# Altium schematic sheet EVB-ANNA-B5_SCHEM_0003_USBhub_FTDI.SchDoc
size A3; Date: 7/24/2020; CompanyName: U-blox; DrawnBy: EMOO; Engineer: EMOO; Organization: U-blox; Address1: 3950 Fairview Industrial Dr SE #100; Address2: Salem, OR 97302; DocumentNumber: 8; SheetNumber: 4; SheetTotal: 8; SheetSize: B; SheetTitle: Interface MCU
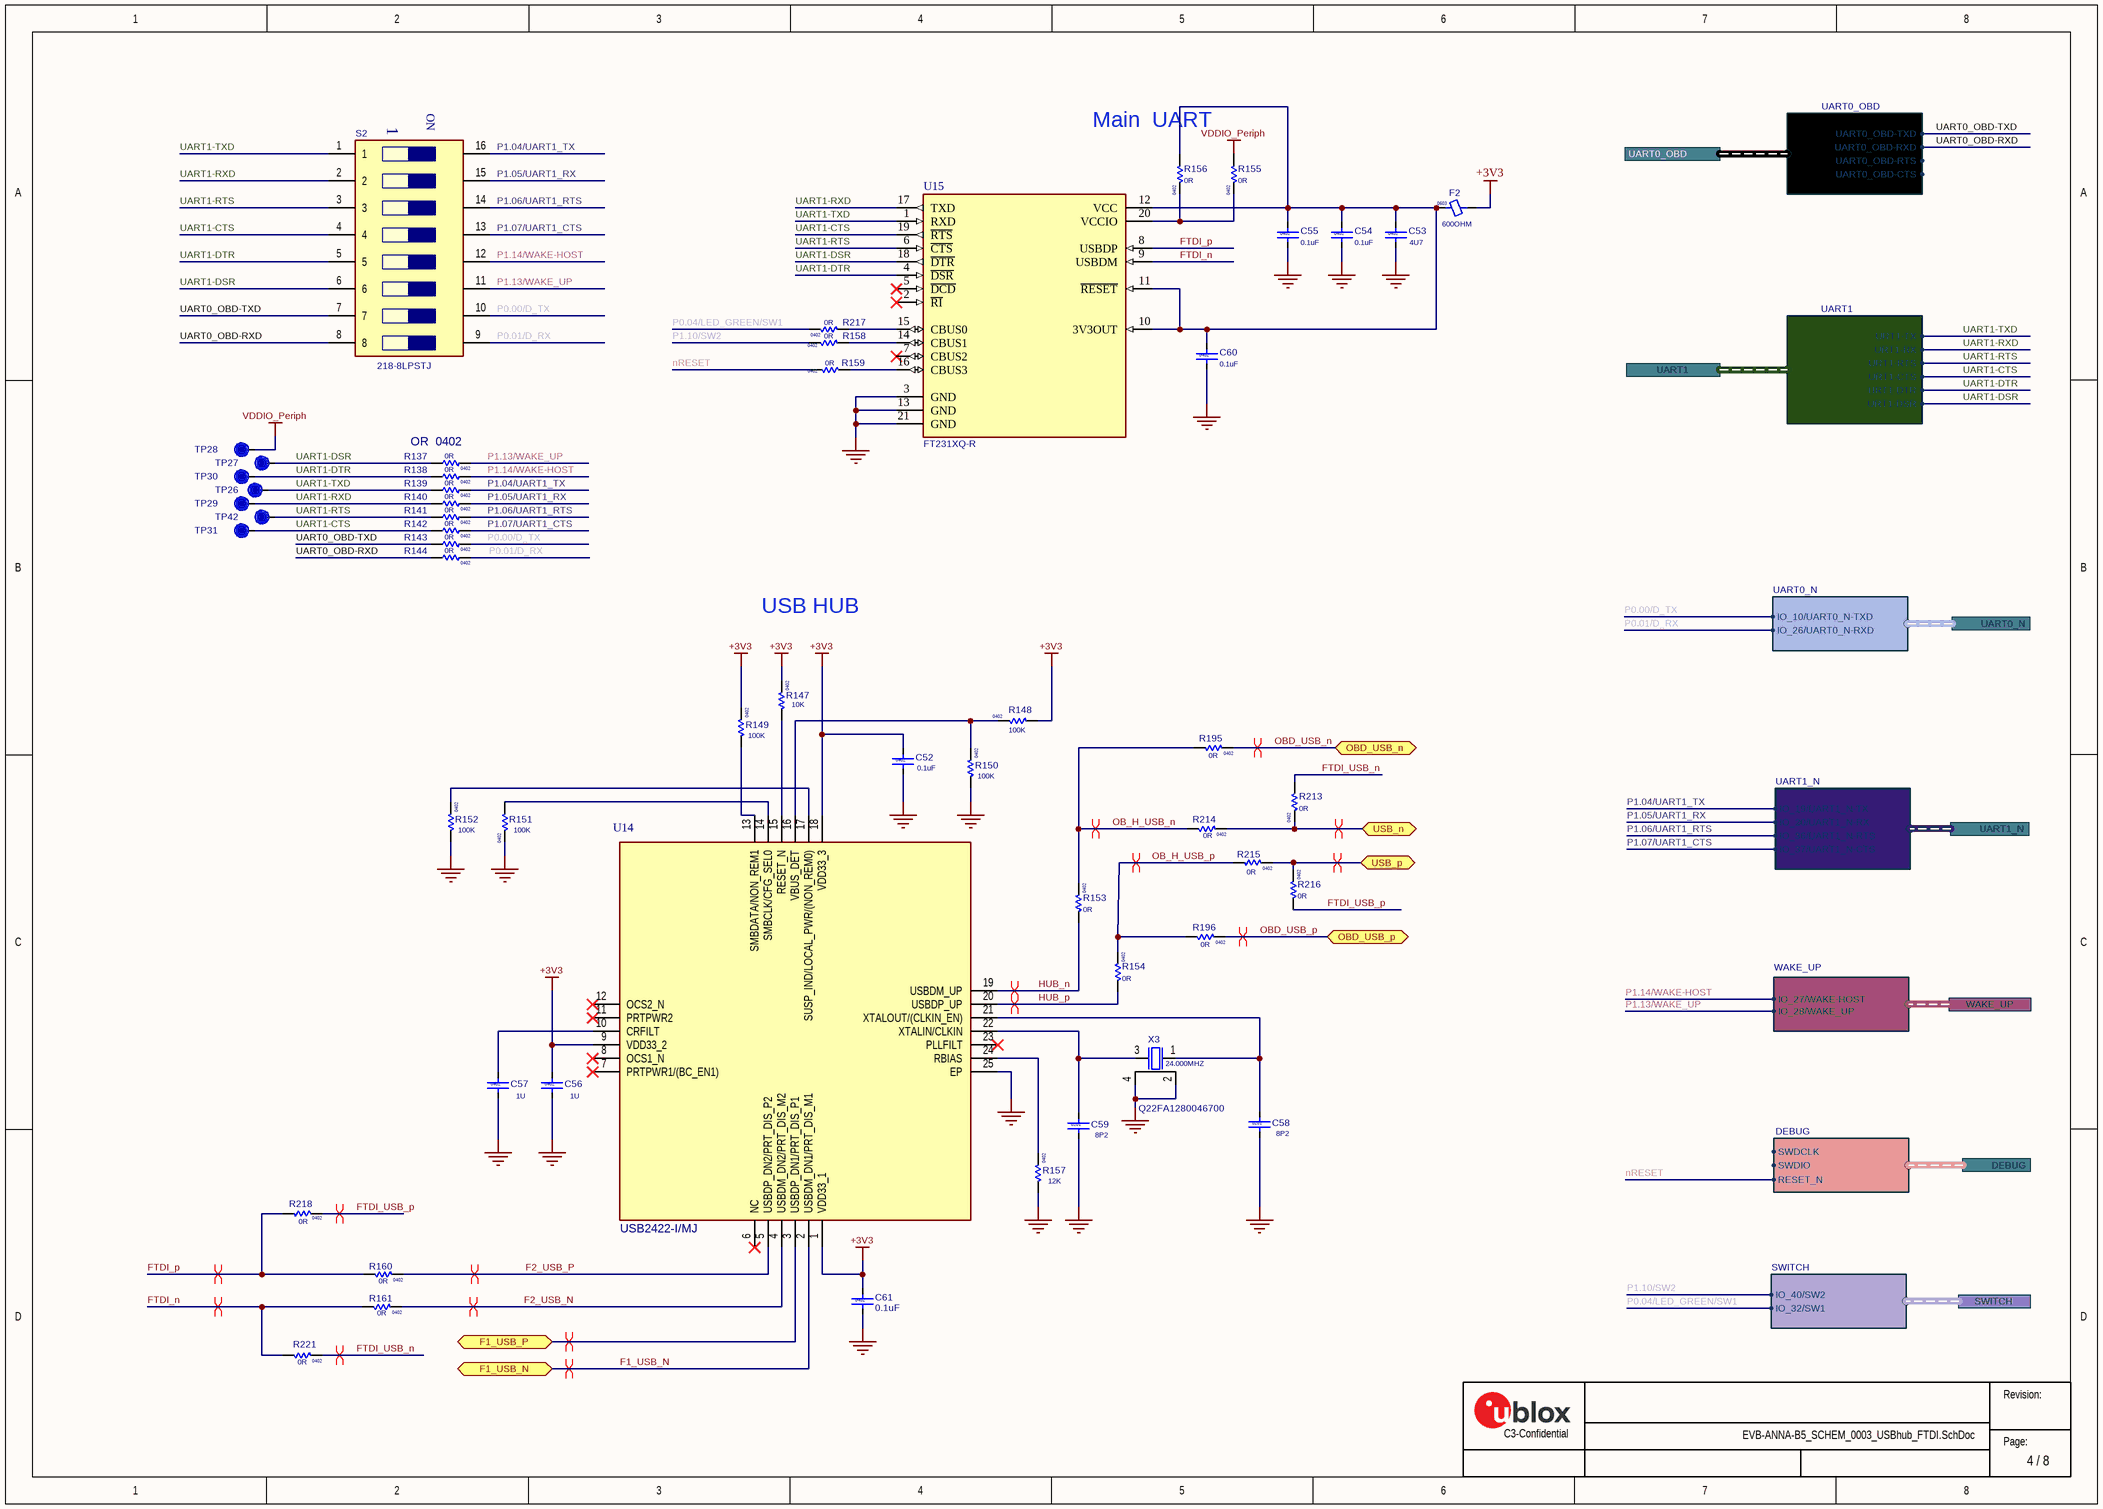
[diagram p0: EVB-ANNA-B5_SCHEM_0003_USBhub_FTDI.SchDoc]

## Parts
C52  value 0.1uF  Size: 0402  [Cap 0402 HD]  (hidden comment: 120-00016)
C53  value 4U7  Size: 0402  [Cap 0402 HD]  (hidden comment: UBXH01-0000243)
C54  value 0.1uF  Size: 0402  [Cap 0402 HD]  (hidden comment: 120-00016)
C55  value 0.1uF  Size: 0402  [Cap 0402 HD]  (hidden comment: 120-00016)
C56  value 1U  Size: 0402  [Cap 0402 HD]  (hidden comment: UBXH01-0000248)
C57  value 1U  Size: 0402  [Cap 0402 HD]  (hidden comment: UBXH01-0000248)
C58  value 8P2  Size: 0201  [Cap 0201 HD]  (hidden comment: UBXH01-0013002)
C59  value 8P2  Size: 0201  [Cap 0201 HD]  (hidden comment: UBXH01-0013002)
C60  value 0.1uF  Size: 0402  [Cap 0402 HD]  (hidden comment: 120-00016)
C61  value 0.1uF  Size: 0402  [Cap 0402 HD]  (hidden comment: 120-00016)
F2  value 600OHM  Size: 0603  [IND_0603_1750Lx950Wx1050H_600x800Pad_800G_FLX]  (hidden comment: UBXH08-0000001)
R137  value 0R  Size: 0402  [RES 0402 HD]  (hidden comment: UBXH18-0003002)
R138  value 0R  Size: 0402  [RES 0402 HD]  (hidden comment: UBXH18-0003002)
R139  value 0R  Size: 0402  [RES 0402 HD]  (hidden comment: UBXH18-0003002)
R140  value 0R  Size: 0402  [RES 0402 HD]  (hidden comment: UBXH18-0003002)
R141  value 0R  Size: 0402  [RES 0402 HD]  (hidden comment: UBXH18-0003002)
R142  value 0R  Size: 0402  [RES 0402 HD]  (hidden comment: UBXH18-0003002)
R143  value 0R  Size: 0402  [RES 0402 HD]  (hidden comment: UBXH18-0003002)
R144  value 0R  Size: 0402  [RES 0402 HD]  (hidden comment: UBXH18-0003002)
R147  value 10K  Size: 0402  [RES 0402 HD]  (hidden comment: UBXH18-0000065)
R148  value 100K  Size: 0402  [RES 0402 HD]  (hidden comment: UBXH18-0000005)
R149  value 100K  Size: 0402  [RES 0402 HD]  (hidden comment: UBXH18-0000005)
R150  value 100K  Size: 0402  [RES 0402 HD]  (hidden comment: UBXH18-0000005)
R151  value 100K  Size: 0402  [RES 0402 HD]  (hidden comment: UBXH18-0000005)
R152  value 100K  Size: 0402  [RES 0402 HD]  (hidden comment: UBXH18-0000005)
R153  value 0R  Size: 0402  [RES 0402 HD]  (hidden comment: UBXH18-0003002)
R154  value 0R  Size: 0402  [RES 0402 HD]  (hidden comment: UBXH18-0003002)
R155  value 0R  Size: 0402  [RES 0402 HD]  (hidden comment: UBXH18-0003002)
R156  value 0R  Size: 0402  [RES 0402 HD]  (hidden comment: UBXH18-0003002)
R157  value 12K  Size: 0402  [RES_0402_1100Lx600Wx400H_500x600Pad_400G_FLX]  (hidden comment: UBXH18-0000133)
R158  value 0R  Size: 0402  [RES_0402_1100Lx600Wx400H_500x600Pad_400G_FLX]  (hidden comment: UBXH18-0003002)
R159  value 0R  Size: 0402  [RES_0402_1100Lx600Wx400H_500x600Pad_400G_FLX]  (hidden comment: UBXH18-0003002)
R160  value 0R  Size: 0402  [RES 0402 HD]  (hidden comment: UBXH18-0003002)
R161  value 0R  Size: 0402  [RES 0402 HD]  (hidden comment: UBXH18-0003002)
R195  value 0R  Size: 0402  [RES 0402 HD]  (hidden comment: UBXH18-0003002)
R196  value 0R  Size: 0402  [RES 0402 HD]  (hidden comment: UBXH18-0003002)
R213  value 0R  Size: 0402  [RES 0402 HD]  (hidden comment: UBXH18-0003002)
R214  value 0R  Size: 0402  [RES 0402 HD]  (hidden comment: UBXH18-0003002)
R215  value 0R  Size: 0402  [RES 0402 HD]  (hidden comment: UBXH18-0003002)
R216  value 0R  Size: 0402  [RES 0402 HD]  (hidden comment: UBXH18-0003002)
R217  value 0R  Size: 0402  [RES 0402 HD]  (hidden comment: UBXH18-0003002)
R218  value 0R  Size: 0402  [RES 0402 HD]  (hidden comment: UBXH18-0003002)
R221  value 0R  Size: 0402  [RES 0402 HD]  (hidden comment: UBXH18-0003002)
S2  (no value)  [2188LPSTJ]
TP26  TP10R  [TP10R]  (value not drawn)  (no BOM)
TP27  TP10R  [TP10R]  (value not drawn)  (no BOM)
TP28  TP10R  [TP10R]  (value not drawn)  (no BOM)
TP29  TP10R  [TP10R]  (value not drawn)  (no BOM)
TP30  TP10R  [TP10R]  (value not drawn)  (no BOM)
TP31  TP10R  [TP10R]  (value not drawn)  (no BOM)
TP42  TP10R  [TP10R]  (value not drawn)  (no BOM)
U14  Manufacturer_Part_Number: USB2422-I/MJ  [QFN50P400X400X100-25N-D]
U15  value FT231XQ-R  [QFN_5x5_FT231XQ]  (hidden comment: UBXH10-0000054)
X3  value 24.000MHZ  Manufacturer P/N: Q22FA1280046700  [XTAL_2016_HD]  (hidden comment: UBXH21-0000066)

## Ports
DEBUG (harness Debug), F1_USB_N (bidir), F1_USB_P (bidir), OBD_USB_n (bidir), OBD_USB_p (bidir), SWITCH (harness SWITCH), UART0_N (harness UART0_N), UART0_OBD (harness UART0_OBD), UART1 (harness UART1), UART1_N (harness UART1_N), USB_n (bidir), USB_p (bidir), WAKE_UP (harness WAKE_UP)

## Harnesses
UART1: URT1-RTS, URT1-CTS, URT1-TX, URT1-RX, URT1-DTR, URT1-DSR
DEBUG: RESET_N, SWDIO, SWDCLK
UART0_OBD: UART0_OBD-TXD, UART0_OBD-RXD, UART0_OBD-RTS, UART0_OBD-CTS
SWITCH: IO_40/SW2, IO_32/SW1
WAKE_UP: IO_27/WAKE-HOST, IO_28/WAKE_UP
UART0_N: IO_10/UART0_N-TXD, IO_26/UART0_N-RXD
UART1_N: IO_36/UART1_N-RTS, IO_37/UART1_N-CTS, IO_19/UART1_N-TX, IO_20/UART1_N-RX

## Nets
+3V3: C52.1 C56.1 C61.1 F2.1 R147.2 R148.2 R149.2 U14.1(VDD33_1) U14.9(VDD33_2) U14.18(VDD33_3)
GND: C52.2 C53.2 C54.2 C55.2 C56.2 C57.2 C58.2 C59.2 C60.2 C61.2 R150.1 R151.2 R152.1 R157.1 U14.25(EP) U15.3(GND) U15.13(GND) U15.21(GND) X3.2 X3.4
VDDIO_Periph: R155.1 TP28.1
F1_USB_N: U14.2(USBDM_DN1/PRT_DIS_M1) ; port F1_USB_N
F1_USB_P: U14.3(USBDP_DN1/PRT_DIS_P1) ; port F1_USB_P
F2_USB_N: R161.2 U14.4(USBDM_DN2/PRT_DIS_M2)
F2_USB_P: R160.2 U14.5(USBDP_DN2/PRT_DIS_P2)
FTDI_n: R161.1 R221.1 U15.9(USBDM)
FTDI_p: R160.1 R218.2 U15.8(USBDP)
FTDI_USB_n: R213.1 R221.2
FTDI_USB_p: R216.1 R218.1
HUB_n: R153.1 U14.19(USBDM_UP)
HUB_p: R154.1 U14.20(USBDP_UP)
nRESET: R159.2 ; port DEBUG.RESET_N
OB_H_USB_n: R153.2 R195.1 R214.1
OB_H_USB_p: R154.2 R196.1 R215.1
OBD_USB_n: R195.2 ; port OBD_USB_n
OBD_USB_p: R196.2 ; port OBD_USB_p
P0.00/D_TX: R143.2 S2.10 ; port UART0_N.IO_10/UART0_N-TXD
P0.01/D_RX: R144.2 S2.9 ; port UART0_N.IO_26/UART0_N-RXD
P0.04/LED_GREEN/SW1: R217.1 ; port SWITCH.IO_32/SW1
P1.04/UART1_TX: R139.2 S2.16 ; port UART1_N.IO_19/UART1_N-TX
P1.05/UART1_RX: R140.2 S2.15 ; port UART1_N.IO_20/UART1_N-RX
P1.06/UART1_RTS: R141.2 S2.14 ; port UART1_N.IO_36/UART1_N-RTS
P1.07/UART1_CTS: R142.2 S2.13 ; port UART1_N.IO_37/UART1_N-CTS
P1.10/SW2: R158.2 ; port SWITCH.IO_40/SW2
P1.13/WAKE_UP: R137.2 S2.11 ; port WAKE_UP.IO_28/WAKE_UP
P1.14/WAKE-HOST: R138.2 S2.12 ; port WAKE_UP.IO_27/WAKE-HOST
UART0_OBD-RXD: R144.1 S2.8 ; port UART0_OBD.UART0_OBD-RXD
UART0_OBD-TXD: R143.1 S2.7 ; port UART0_OBD.UART0_OBD-TXD
UART1-CTS: R142.1 S2.4 TP31.1 U15.19(~{RTS}) ; port UART1.URT1-CTS
UART1-DSR: R137.1 S2.6 TP27.1 U15.18(~{DTR}) ; port UART1.URT1-DSR
UART1-DTR: R138.1 S2.5 TP30.1 U15.4(~{DSR}) ; port UART1.URT1-DTR
UART1-RTS: R141.1 S2.3 TP42.1 U15.6(~{CTS}) ; port UART1.URT1-RTS
UART1-RXD: R140.1 S2.2 TP29.1 U15.17(TXD) ; port UART1.URT1-RX
UART1-TXD: R139.1 S2.1 TP26.1 U15.1(RXD) ; port UART1.URT1-TX
USB_n: R213.2 R214.2 ; port USB_n
USB_p: R215.2 R216.2 ; port USB_p
NetC53_1: C53.1 C54.1 C55.1 C60.1 F2.2 R156.1 U15.10(3V3OUT) U15.11(~{RESET}) U15.12(VCC)
NetC57_1: C57.1 U14.10(CRFILT)
NetC58_1: C58.1 U14.21(XTALOUT/(CLKIN_EN)) X3.1
NetC59_1: C59.1 U14.22(XTALIN/CLKIN) X3.3
NetR147_1: R147.1 U14.15(RESET_N)
NetR148_1: R148.1 R150.2 U14.16(VBUS_DET)
NetR149_1: R149.1 U14.13(SMBDATA/NON_REM1)
NetR151_1: R151.1 U14.14(SMBCLK/CFG_SEL0)
NetR152_2: R152.2 U14.17(SUSP_IND/LOCAL_PWR/(NON_REM0))
NetR155_2: R155.2 R156.2 U15.20(VCCIO)
NetR157_2: R157.2 U14.24(RBIAS)
NetR158_1: R158.1 U15.14(CBUS1)
NetR159_1: R159.1 U15.16(CBUS3)
NetR217_2: R217.2 U15.15(CBUS0)

Not connected (* = marked no-connect by the designer): U14 6(NC)* 7(PRTPWR1/(BC_EN1))* 8(OCS1_N)* 11(PRTPWR2)* 12(OCS2_N)* 23(PLLFILT)*; U15 2(~{RI})* 5(~{DCD})* 7(CBUS2)*

## Layout directives
differential pair: F1_USB_N, F1_USB_P, F2_USB_N, F2_USB_P, FTDI_n, FTDI_p, FTDI_USB_n, FTDI_USB_p, HUB_n, HUB_p, OB_H_USB_n, OB_H_USB_p, OBD_USB_n, OBD_USB_p, USB_n, USB_p

## Notes on the sheet
- Main  UART
- (near R137) OR  0402
- USB HUB
- Revision:
- C3-Confidential
- Page:
- (in symbol 218-8LPSTJ) ON

## Library data of the parts
C52 C54 C55 C60 C61 = 120-00016: Cap, Ceramic 0.1uF 10V 10% X5R 0402; Part Name: CAP CER 0.1UF 10V 10% X5R 0402; Part_Type: Ceramic Capacitor; Manufacturer: Murata Electronics North America; Manufacturer P/N: GRM155R61A104KA01J; Item_Phase: Production; Component Mounting Type: SMT; Tolerance: +/- 10%; Use in new designs: Yes; Part Number: 120-00016; Revision: 0A; Supplier 1: Digi-Key; Supplier Part Number 1: 490-6297-1-ND; Manufacturer 2: Yageo; Manufacturer P/N 2: CC0402KRX5R6BB104; Supplier 2: Digi-Key; Supplier Part Number 2: 311-1336-1-ND; Arena Link: https://app.bom.com/a/GYHPV2L2L43KRMBK?v=spec.summary; Height: 0.55mm; Pins: 2; Temperature Coefficient: X5R; Voltage: 10V
C53 = UBXH01-0000243: CAP CER X5R 0402 4U7 20% 10V; Manufacturer: Murata Manufacturing Company, Ltd.; Manufacturer P/N: GRM155R61A475MEAA; Editor: martin.pilik; Released by: fabrice.bret-dibat; Env: GREEN; Permitted Use: Volume Products; Perferred: PREF; Mfg P/N Status: Active; Mfg P/N Split: 100; Mfg P/N Released: Yes; Part Number: UBXH01-0000243; Tolerance: 20%; Max Voltage: 10V; Min Operating Temp: -40°C; Max Operating Temp: 85°C; Part Type: Capacitor; Release Data: 2021-05-10 12:57:47.325652; UBX Wiki: https://wiki.u-blox.com/bin/view/Operations/PartDetails?index=24303; RefDes: C; Mfg P/N Datasheet: https://wiki.u-blox.com/bin/view/Generic/Docs/DocumentSummary?index=24302
C56 C57 = UBXH01-0000248: CAP CER X5R 0402 1U 10% 10V; Manufacturer: Murata Manufacturing Company, Ltd.; Manufacturer P/N: GRM155R61C105KA12; Editor: michael.hein; Released by: igor.shevchenko; Env: ROHS; Permitted Use: Volume Products; Perferred: PREF; Mfg P/N Status: Active; Mfg P/N Split: 100; Mfg P/N Released: Yes; Part Number: UBXH01-0000248; Tolerance: 10%; Max Voltage: 10V; Min Operating Temp: -40°C; Max Operating Temp: 85°C; Part Type: Capacitor; Release Data: 2016-03-16T11:26:35; UBX Wiki: https://wiki.u-blox.com/bin/view/Operations/PartDetails?index=24378; RefDes: C; Mfg P/N Datasheet: https://wiki.u-blox.com/bin/view/Generic/Docs/DocumentSummary?index=29581; Manufacturer 2: TDK Corporation; Manufacturer P/N 2: C1005X5R1E105K050BC; Mfg P/N Status 2: Active; Mfg P/N Split 2: 0; Mfg P/N Released 2: Yes; Mfg P/N Datasheet 2: https://wiki.u-blox.com/bin/view/Generic/Docs/DocumentSummary?index=28058; Manufacturer 3: Samsung Electro-Mechanics; Manufacturer P/N 3: CL05A105KA5NQNC; Mfg P/N Status 3: Active; Mfg P/N Split 3: 0; Mfg P/N Released 3: Yes; Mfg P/N Datasheet 3: https://wiki.u-blox.com/bin/view/Generic/Docs/DocumentSummary?index=28056
C58 C59 = UBXH01-0013002: CAP CER C0G 0201 8P2 +/-0.5P 25V; Manufacturer: Murata Manufacturing Company, Ltd.; Manufacturer P/N: GRM0335C1E8R2DA01; Editor: roland.rust; Env: ROHS; Permitted Use: Volume Products; Perferred: PREF; Mfg P/N Status: Active; Mfg P/N Split: 100; Mfg P/N Released: Yes; Part Number: UBXH01-0013002; Tolerance: +/-0.5P; Max Voltage: 25V; Part Type: Capacitor; Released by: roland.rust; Release Data: 2009-03-23T10:34:14; UBX Wiki: https://wiki.u-blox.com/bin/view/Operations/PartDetails?index=5090; RefDes: C; Manufacturer 2: Murata Manufacturing Company, Ltd.; Manufacturer P/N 2: GRM0335C1E8R2D; Mfg P/N Status 2: Active; Mfg P/N Split 2: 0; Mfg P/N Released 2: Obsolete
F2 = UBXH08-0000001: FERRITE BEAD 0603 600 OHM AT 100MHZ 600OHM 500mA; Manufacturer: TDK Corporation; Manufacturer P/N: MMZ1608B601C; Editor: daniel.hurni; Released by: martin.frauchiger; Env: ROHS; Permitted Use: Support Products; Perferred: PREF; Mfg P/N Status: Active; Mfg P/N Split: 100; Mfg P/N Released: Yes; Part Number: UBXH08-0000001; Max Current: 500mA; Min Operating Temp: -40°C; Max Operating Temp: 125°C; Part Type: Ferrite; Release Data: 2009-12-02T10:18:36; UBX Wiki: https://wiki.u-blox.com/bin/view/Operations/PartDetails?index=7960; RefDes: FB; Mfg P/N Datasheet: https://wiki.u-blox.com/bin/view/Generic/Docs/DocumentSummary?index=7941
R137-R144 R153 R154 R158-R161 R195 R196 R213-R216 R218 R221 = UBXH18-0003002: RES THICK FILM CHIP 0402 0R 0 100mW; Manufacturer: KOA; Manufacturer P/N: RK73Z1ETTD; Tolerance: 0; Editor: charlotte.biber; Released by: peter.mueller; Env: ROHS; Permitted Use: Volume Products; Perferred: PREF; Mfg P/N Status: NRND; Mfg P/N Split: 100; Mfg P/N Released: Yes; Part Number: UBXH18-0003002; Max Power: 100mW; Part Type: Resistor; UBX Wiki: https://wiki.u-blox.com/bin/view/Operations/PartDetails?index=6611; RefDes: R; Manufacturer 2: YAGEO; Manufacturer P/N 2: 2322_705_91001_L; Mfg P/N Split 2: 0; Mfg P/N Released 2: Yes
  R137-R144 R153 R154 R160 R161 R195 R196 R213-R216 R218 R221: Release Data: 2012-06-05 09:49:55.978616; Mfg P/N Status 2: NRND
  R158 R159: Release Data: 2012-06-05T09:49:55; Mfg P/N Status 2: Obsolete; Case/Package: 0x0y
R147 = UBXH18-0000065: RES THICK FILM CHIP 0402 10K 1% 63mW; Manufacturer: KOA; Manufacturer P/N: RK73H1ETTP1002F; Editor: erian.bezhani; Released by: massimo.vlacci; Env: ROHS; Permitted Use: Volume Products; Perferred: PREF; Mfg P/N Status: Active; Mfg P/N Split: 100; Mfg P/N Released: Yes; Part Number: UBXH18-0000065; Tolerance: 1%; Max Power: 63mW; Part Type: Resistor; Release Data: 2012-06-08 18:02:21.521517; UBX Wiki: https://wiki.u-blox.com/bin/view/Operations/PartDetails?index=16837; RefDes: R; Mfg P/N Datasheet: https://wiki.u-blox.com/bin/view/Generic/Docs/DocumentSummary?index=8222
R148-R152 = UBXH18-0000005: RES THICK FILM CHIP 0402 100K 1% 63mW; Manufacturer: KOA; Manufacturer P/N: RK73H1ETTP1003F; Editor: dario.antonaz; Released by: sandro.sestan; Env: ROHS; Permitted Use: Volume Products; Mfg P/N Status: Active; Mfg P/N Split: 100; Mfg P/N Released: Yes; Part Number: UBXH18-0000005; Tolerance: 1%; Max Power: 63mW; Part Type: Resistor; Release Data: 2009-11-30T11:05:22; UBX Wiki: https://wiki.u-blox.com/bin/view/Operations/PartDetails?index=8114; Perferred: N/A; RefDes: R; Mfg P/N Datasheet: https://wiki.u-blox.com/bin/view/Generic/Docs/DocumentSummary?index=8222; Manufacturer 2: ROHM; Manufacturer P/N 2: MCR01MZPF1003; Mfg P/N Status 2: Obsolete; Mfg P/N Split 2: 0; Mfg P/N Released 2: Yes; Mfg P/N Datasheet 2: https://wiki.u-blox.com/bin/view/Generic/Docs/DocumentSummary?index=8186
R155 R156 R217 = UBXH18-0003002: RES THICK FILM CHIP 0402 0R 0 100mW; Manufacturer: KOA; Manufacturer P/N: RK73Z1ETTP; Tolerance: 0; Editor: charlotte.biber; Released by: peter.mueller; Env: ROHS; Permitted Use: Volume Products; Perferred: PREF; Mfg P/N Status: NRND; Mfg P/N Split: 100; Mfg P/N Released: Yes; Part Number: UBXH18-0003002; Max Power: 100mW; Part Type: Resistor; Release Data: 2012-06-05 09:49:55.978616; UBX Wiki: https://wiki.u-blox.com/bin/view/Operations/PartDetails?index=6611; RefDes: R; Manufacturer 2: YAGEO; Manufacturer P/N 2: 2322_705_91001_L; Mfg P/N Status 2: NRND; Mfg P/N Split 2: 0; Mfg P/N Released 2: Yes
R157 = UBXH18-0000133: RES THICK FILM CHIP 0402 12K 1% 62.5mW; Manufacturer: YAGEO; Manufacturer P/N: RT0402FRE0712KL; Editor: pierpaolo.arban; Released by: dario.antonaz; Env: ROHS; Permitted Use: Volume Products; Perferred: PREF; Mfg P/N Status: Active; Mfg P/N Split: 100; Mfg P/N Released: Yes; Part Number: UBXH18-0000133; Tolerance: 1%; Max Power: 62.5mW; Min Operating Temp: -55°C; Max Operating Temp: 155°C; Part Type: Resistor; Release Data: 2019-11-07T09:33:25; UBX Wiki: https://wiki.u-blox.com/bin/view/Operations/PartDetails?index=20511; RefDes: R; Mfg P/N Datasheet: https://wiki.u-blox.com/bin/view/Generic/Docs/DocumentSummary?index=19276
S2 = 218-8LPSTJ: Switch; Manufacturer_Name: CTS; Datasheet Link: https://www.ctscorp.com/wp-content/uploads/218.pdf; Height: 2.7mm; Manufacturer_Part_Number: 218-8LPSTJ; Mouser Part Number: 774-2188LPSTJ; Mouser Price/Stock: https://www.mouser.co.uk/ProductDetail/CTS-Electronic-Components/218-8LPSTJ?qs=hDoPxpGr7lfoBDyeqUpd9g%3D%3D; Arrow Part Number: 218-8LPSTJ; Arrow Price/Stock: https://www.arrow.com/en/products/218-8lpstj/cts
TP26-TP31 TP42 = TP10R: Testpoint, Round 1.0mm Dia; Added By: Jeremy D; Part Number: TP10R; Size: 1.0mm; Height: 0; DNP: DNP; Added Date: 2/1/2015; Checked By: Paul B; Checked Date: 2/5/2015
U14 = USB2422-I_MJ: Integrated Circuit; Manufacturer_Name: Microchip; Datasheet Link: https://datasheet.datasheetarchive.com/originals/distributors/DKDS-15/280029.pdf; Height: 1mm; Mouser Part Number: 579-USB2422-I/MJ; Mouser Price/Stock: https://www.mouser.co.uk/ProductDetail/Microchip-Technology-Atmel/USB2422-I-MJ?qs=eTPcRhULBzzm1uvzgv8YJg%3D%3D; Arrow Part Number: USB2422-I/MJ; Arrow Price/Stock: https://www.arrow.com/en/products/usb2422-imj/microchip-technology?region=nac
U15 = UBXH10-0000054: FTDI USB TO SERIAL FULL UART INTERFACE QFN20; Manufacturer: FTDI Future Technology Devices International; Editor: adam.johansson; Env: ROHS; Permitted Use: Support Products; Perferred: PREF; Mfg P/N Status: Active; Mfg P/N Split: 100; Mfg P/N Released: No; Part Number: UBXH10-0000054; Min Operating Temp: -40°C; Max Operating Temp: 85°C; Part Type: Interface; UBX Wiki: https://wiki.u-blox.com/bin/view/Operations/PartDetails?index=27258; RefDes: U; Manufacturer P/N: FT231XQ-R; Mfg P/N Datasheet: https://wiki.u-blox.com/bin/view/Generic/Docs/DocumentSummary?index=33707
X3 = UBXH21-0000066: CRYSTAL CL=8PF EPSON 2.0X1.6MM 24.000MHZ 30PPM; Manufacturer: Seiko Epson Corporation; Editor: adam.johansson; Released by: olof.viklund; Critical: Yes; Env: ROHS; Permitted Use: Volume Products; Perferred: PREF; Mfg P/N Status: Active; Mfg P/N Split: 100; Part Number: UBXH21-0000066; Tolerance: 30PPM; Min Operating Temp: -40°C; Max Operating Temp: 85°C; Part Type: Crystal; Release Data: 2015-11-11T10:35:48; UBX Wiki: https://wiki.u-blox.com/bin/view/Operations/PartDetails?index=21963; RefDes: Y; Mfg P/N Released: Yes; Mfg P/N Datasheet: https://wiki.u-blox.com/bin/view/Generic/Docs/DocumentSummary?index=23017; Manufacturer 2: Seiko Epson Corporation; Manufacturer P/N 2: Q22FA1280039800; Mfg P/N Status 2: Obsolete; Mfg P/N Split 2: 0; Mfg P/N Released 2: Obsolete; Mfg P/N Datasheet 2: https://wiki.u-blox.com/bin/view/Generic/Docs/DocumentSummary?index=21965